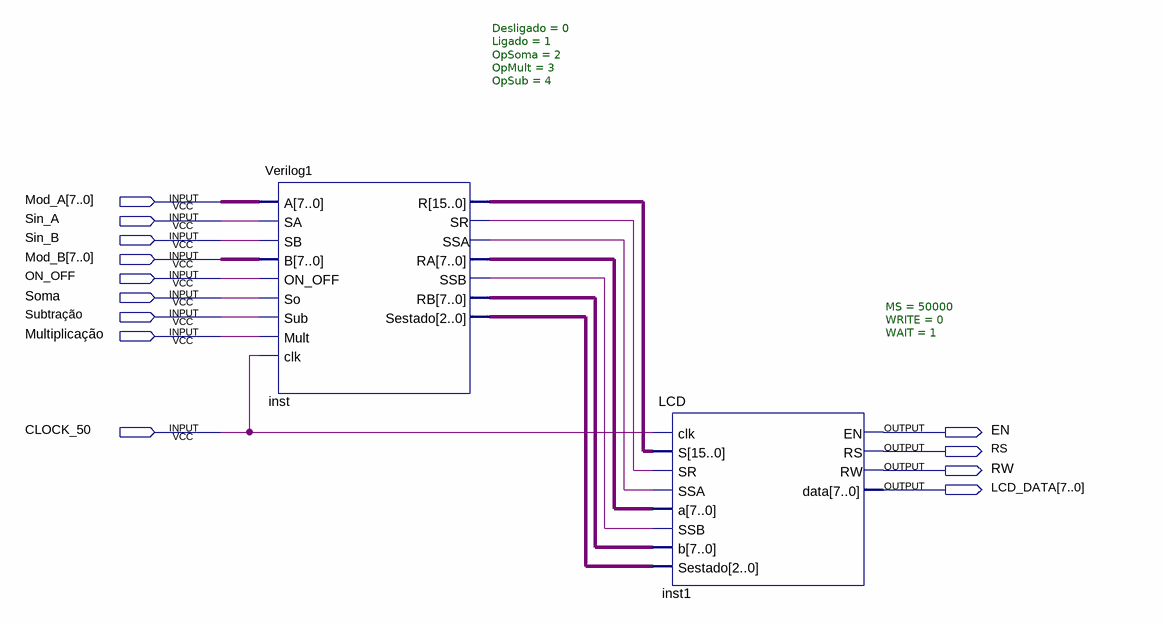
[diagram p0: schematic sheet]
// Quartus schematic topado.bdf as structural Verilog: 2 symbols, 13 pins
module topado (
  input  [7:0] Mod_A,
  input  Sin_A,
  input  Sin_B,
  input  [7:0] Mod_B,
  input  ON_OFF,
  input  Soma,
  input  \Subtração ,
  input  \Multiplicação ,
  input  CLOCK_50,
  output EN,
  output RS,
  output RW,
  output [7:0] LCD_DATA
);

  wire inst_sr, inst_ssa, inst_ssb;
  wire [2:0] inst_sestado;
  wire [7:0] inst_ra, inst_rb;
  wire [15:0] inst_r;

  Verilog1 #(.Desligado(0), .Ligado(1), .OpSoma(2), .OpMult(3), .OpSub(4)) inst (
    .A(Mod_A), .SA(Sin_A), .SB(Sin_B), .B(Mod_B), .ON_OFF(ON_OFF), .So(Soma), .Sub(\Subtração ),
    .Mult(\Multiplicação ), .clk(CLOCK_50), .R(inst_r), .SR(inst_sr), .SSA(inst_ssa), .RA(inst_ra),
    .SSB(inst_ssb), .RB(inst_rb), .Sestado(inst_sestado));
  LCD #(.MS(50000), .WRITE(0), .WAIT(1)) inst1 (
    .clk(CLOCK_50), .S(inst_r), .SR(inst_sr), .SSA(inst_ssa), .a(inst_ra), .SSB(inst_ssb), .b(inst_rb),
    .Sestado(inst_sestado), .EN(EN), .RS(RS), .RW(RW), .data(LCD_DATA));
endmodule
